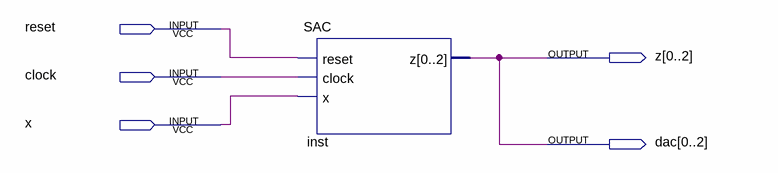
[diagram p0: schematic sheet]
// Quartus schematic SAC.bdf as structural Verilog: 1 symbols, 5 pins
module SAC (
  input  reset,
  input  clock,
  input  x,
  output [0:2] z,
  output [0:2] dac
);

  SAC inst (.reset(reset), .clock(clock), .x(x), .z(dac));

  assign z = dac;
endmodule
